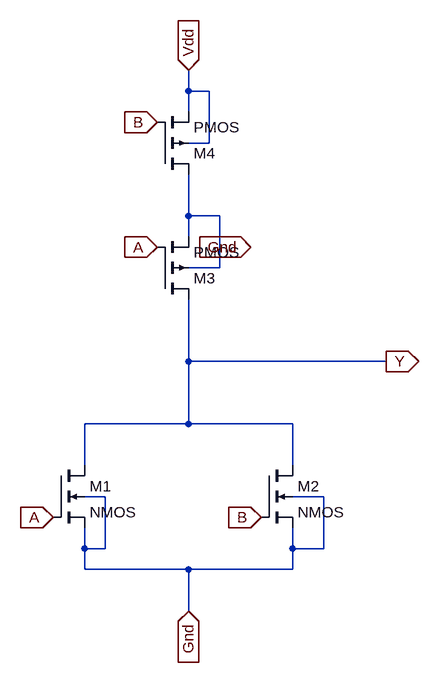
[diagram p0: schematic nor.asc]
nor.asc, the LTspice schematic file:
Version 4
SHEET 1 880 760
WIRE -96 -240 -96 -272
WIRE -64 -240 -96 -240
WIRE -96 -208 -96 -240
WIRE -64 -160 -64 -240
WIRE -64 -160 -96 -160
WIRE -96 -48 -96 -112
WIRE -48 -48 -96 -48
WIRE -96 -16 -96 -48
WIRE -48 32 -48 -48
WIRE -48 32 -96 32
WIRE -96 176 -96 80
WIRE 208 176 -96 176
WIRE -96 272 -96 176
WIRE -96 272 -256 272
WIRE 64 272 -96 272
WIRE -256 336 -256 272
WIRE 64 336 64 272
WIRE -224 384 -256 384
WIRE 112 384 64 384
WIRE -256 464 -256 432
WIRE -224 464 -224 384
WIRE -224 464 -256 464
WIRE 64 464 64 432
WIRE 112 464 112 384
WIRE 112 464 64 464
WIRE -256 496 -256 464
WIRE -96 496 -256 496
WIRE 64 496 64 464
WIRE 64 496 -96 496
WIRE -96 560 -96 496
FLAG -96 -272 Vdd
IOPIN -96 -272 In
FLAG -304 416 A
IOPIN -304 416 In
FLAG -144 0 A
IOPIN -144 0 In
FLAG -144 -192 B
IOPIN -144 -192 In
FLAG 16 416 B
IOPIN 16 416 In
FLAG 208 176 Y
IOPIN 208 176 Out
FLAG -96 560 Gnd
IOPIN -96 560 In
FLAG 0 0 Gnd
IOPIN 0 0 In
SYMBOL nmos4 -304 336 R0
SYMATTR InstName M1
SYMBOL nmos4 16 336 R0
SYMATTR InstName M2
SYMBOL pmos4 -144 80 M180
SYMATTR InstName M3
SYMBOL pmos4 -144 -112 M180
SYMATTR InstName M4

The netlist it stands for:
* nor.asc
M1 Y A Gnd Gnd NMOS
M2 Y B Gnd Gnd NMOS
M3 Y A N001 N001 PMOS
M4 N001 B Vdd Vdd PMOS
.model NMOS NMOS
.model PMOS PMOS
.lib standard.mos
.backanno
.end